# EasyEDA Pro project 单向户外电源_明月班.epro, board PCB4
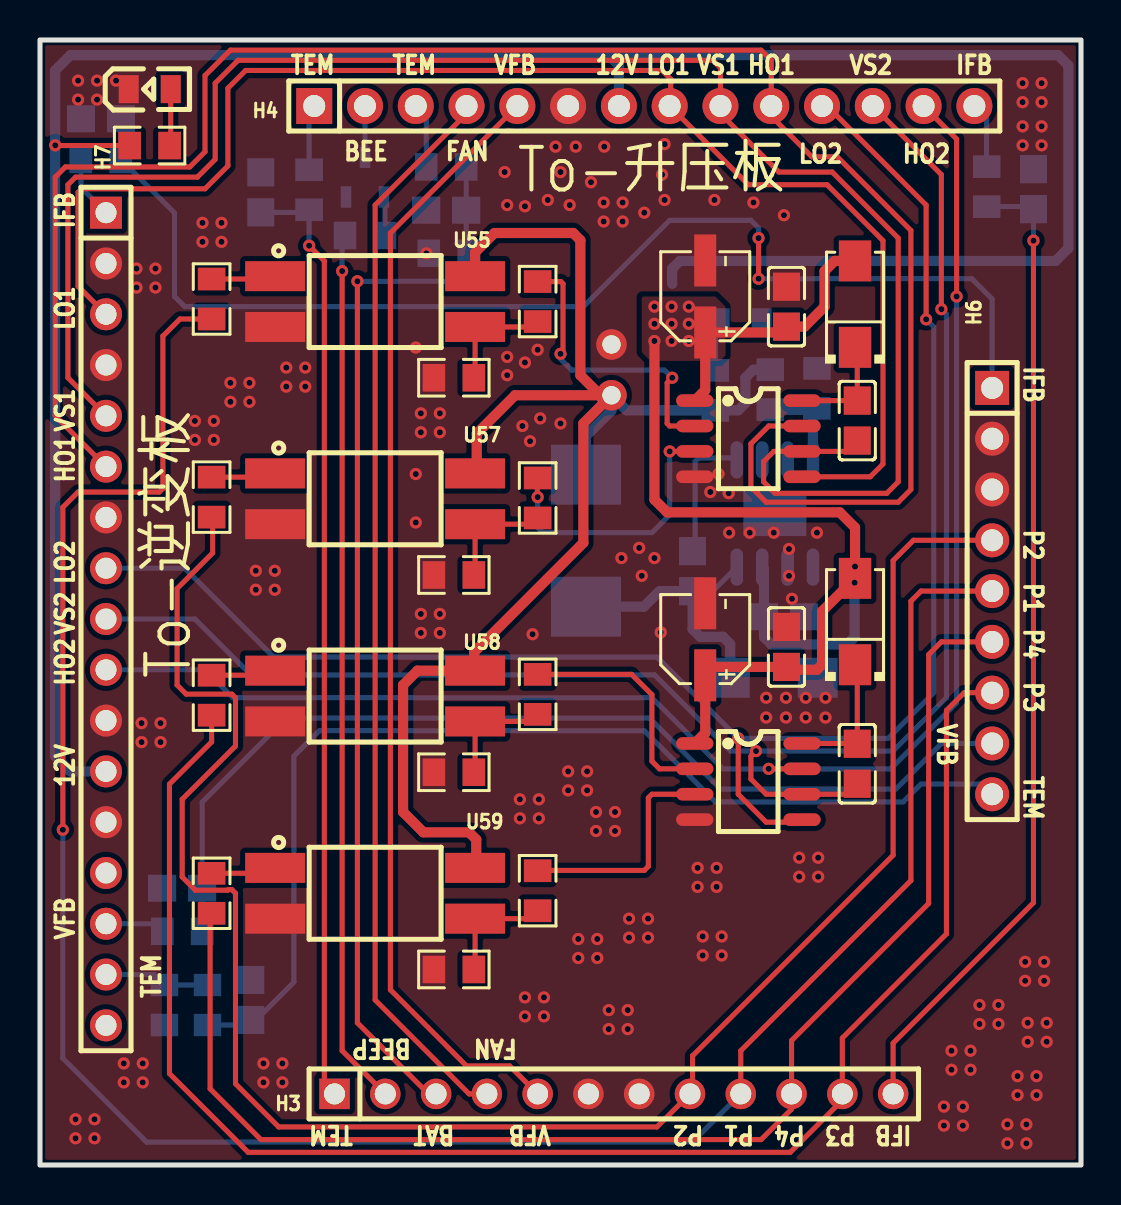
[diagram p12: board, top side]
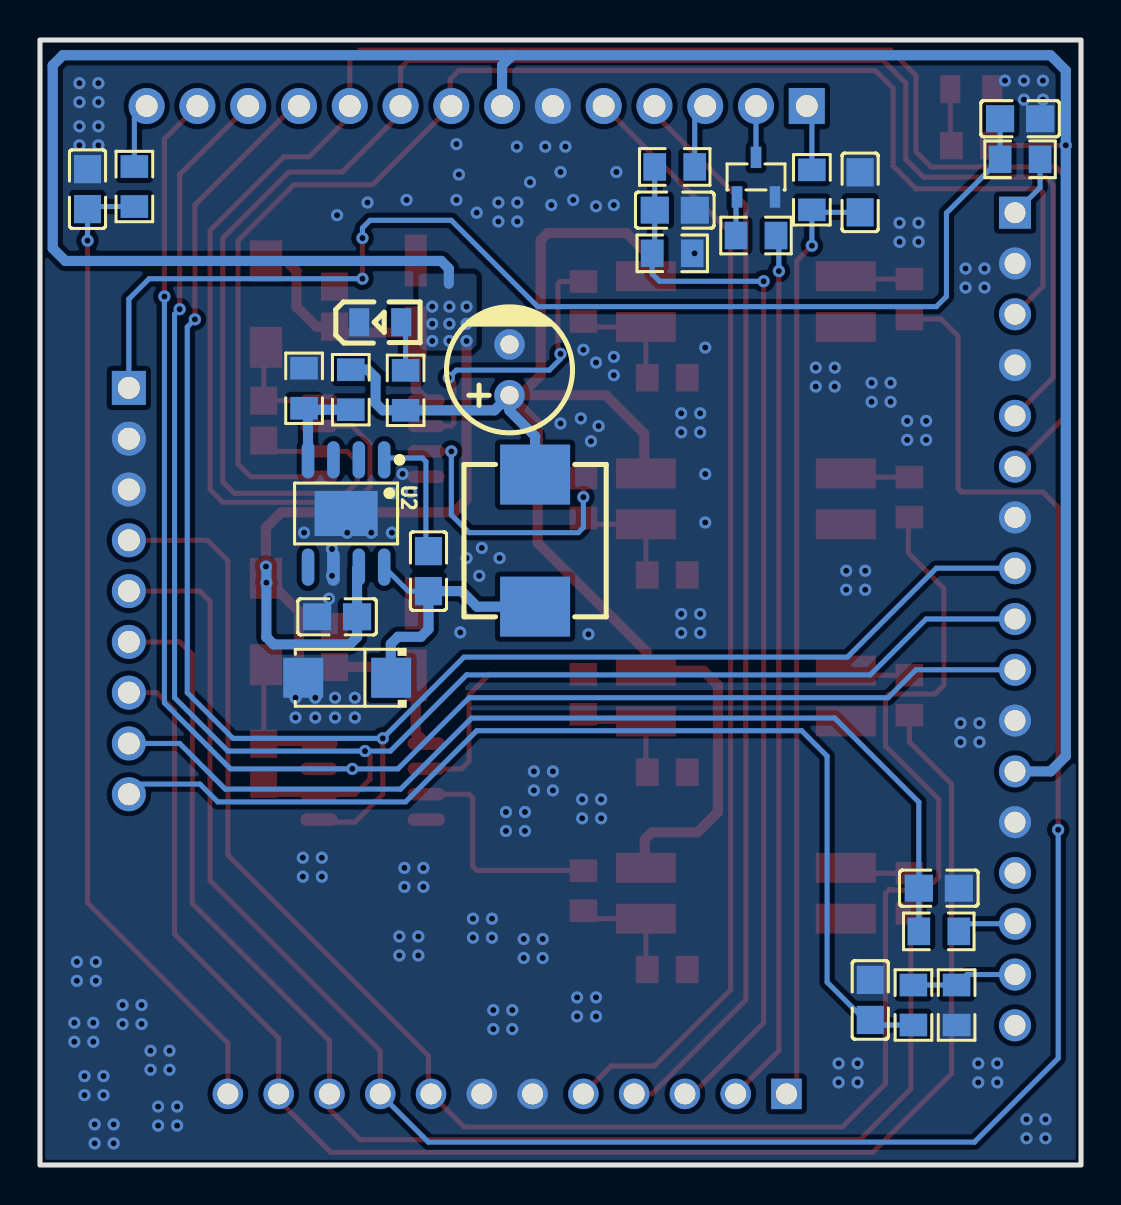
[diagram p13: board, bottom side, seen from below]

Outline 52.07 x 56.26 mm; copper layers: Top Layer, Bottom Layer. Coordinates in mm from the lower left corner of the outline.
Outline path: rectangle 0,56.26 52.07,0
Stack: Top Layer 0.035mm / Dielectric1 1.51mm FR4 er 4.5 / Bottom Layer 0.035mm

## Design rules (mm)
template: 自定义配置
spacing copperThickness1oz (default): track to track 0.102, other pairs 0.152 to 0.3
spacing copperThickness2oz: track to track 0.203, other pairs 0.152 to 0.3
track width copperThickness1oz (default): min 0.127, default 0.254, max 2.54
track width copperThickness2oz: min 0.203, default 0.254, max 2.54
differential pair differentialPair (default): width min 0.127, default 0.254, max 2.54; gap min 0.152, default 0.152
via viaSize (default): diameter min 0.5, default 0.61, max 10; hole min 0.3, default 0.305, max 6.3

## Placement (name value [footprint] x y rotation side)
C16  10uF  [CAP-SMD_BD4.0-L4.3-W4.3-LS5.1-FD]  33.27 43.43 90 top
C17  100nF  [C0805]  37.34 42.93 90 top
C18  1uF  [C0805]  40.88 37.23 90 top
C19  10uF  [CAP-SMD_BD4.0-L4.3-W4.3-LS5.1-FD]  33.27 26.29 90 top
C20  100nF  [C0805]  37.34 25.91 90 top
C21  1uF  [C0805]  40.88 20.07 90 top
C23  220uF  [CAP-D6.3×F2.5]  28.59 39.76 90 bottom
C25  100nF  [C0805]  49.69 48.8 270 bottom
C26  100nF  [C0805]  20.32 47.75 0 bottom
C27  100nF  [C0805]  11.05 48.64 270 bottom
C28  100nF  [C0805]  10.54 8.26 270 bottom
C29  100nF  [C0805]  7.11 13.84 0 bottom
C30  100nF  [C0805]  3.05 52.32 0 bottom
C31  10uF  [C0805]  37.21 27.41 180 bottom
C32  10nF  [C0805]  32.64 29.7 270 bottom
D18  FR107  [SMA_L4.2-W2.7-LS5.3-RD]  40.77 43.05 90 top
D19  FR107  [SMA_L4.2-W2.7-LS5.3-RD]  40.77 27.18 90 top
D20  B340A  [SMA_L4.3-W2.6-LS5.1-RD]  36.7 24.37 0 bottom
H3  -  [HDR-TH_12P-P2.54-V-M]  28.7 3.56 0 top
H4  -  [HDR-TH_14P-P2.54-V-M]  30.23 52.96 0 top
H6  -  [HDR-TH_9P-P2.54-V-M]  47.63 28.7 270 top
H7  -  [HDR-TH_17P-P2.54-V-M]  3.3 27.31 270 top
L1  15uH  [IND-SMD_L7.5-W6.6]  27.3 31.22 90 bottom
LED1  NCD0805R1  [LED0805-R-RD]  35.05 42.15 180 bottom
LED2  NCD0805R1  [LED0805-R-RD]  5.49 53.8 0 top
Q11  S8050  [SOT-23-3_L2.9-W1.3-P1.90-LS2.3-BR]  16.26 49.4 270 bottom
R25  100R  [R0805]  8.58 43.31 90 top
R26  100R  [R0805]  24.89 43.18 90 top
R27  10K  [R0805]  20.7 39.37 0 top
R28  100R  [R0805]  8.58 33.4 90 top
R29  100R  [R0805]  24.89 33.36 90 top
R30  10K  [R0805]  20.7 29.51 0 top
R31  100R  [R0805]  8.58 23.5 90 top
R32  100R  [R0805]  24.89 23.54 90 top
R33  10K  [R0805]  20.7 19.64 0 top
R34  100R  [R0805]  8.58 13.59 90 top
R35  100R  [R0805]  24.89 13.72 90 top
R36  10K  [R0805]  20.7 9.78 0 top
R39  10K  [R0805]  47.35 48.93 270 bottom
R40  1K  [R0805]  16.26 46.48 180 bottom
R41  22K  [R0805]  20.32 49.91 0 bottom
R42  2K  [R0805]  20.45 45.59 0 bottom
R43  1K  [R0805]  13.46 48.77 270 bottom
R44  10K  [R0805]  6.22 8 90 bottom
R45  1K  [R0805]  8.38 8 90 bottom
R46  1K  [R0805]  7.11 11.68 0 bottom
R47  1K  [R0805]  3.05 50.29 0 bottom
R50  10K  [R0805]  5.48 50.98 180 top
R51  2.7K  [R0805]  33.78 38.74 270 bottom
R52  3.24K  [R0805]  38.86 38.84 270 bottom
R53  10K  [R0805]  36.52 38.77 90 bottom
U2  TPS5430DDA  [ESOP-8_L4.9-W3.9-P1.27-LS6.0-BL-EP-2]  36.76 32.58 0 bottom
U55  LTV-817S-TA1-C  [OPTO-SMD-4_L4.6-W6.5-P2.54-LS10.3-BL]  16.76 43.18 270 top
U56  EG2132  [SOP-8_L4.9-W3.9-P1.27-LS6.0-BL]  35.43 36.32 270 top
U57  LTV-817S-TA1-C  [OPTO-SMD-4_L4.6-W6.5-P2.54-LS10.3-BL]  16.76 33.32 270 top
U58  LTV-817S-TA1-C  [OPTO-SMD-4_L4.6-W6.5-P2.54-LS10.3-BL]  16.76 23.45 270 top
U59  LTV-817S-TA1-C  [OPTO-SMD-4_L4.6-W6.5-P2.54-LS10.3-BL]  16.76 13.59 270 top
U60  EG2132  [SOP-8_L4.9-W3.9-P1.27-LS6.0-BL]  35.43 19.18 270 top

## Footprints (pads in the part's own frame, mm; a bottom-side part is the same pattern mirrored in y, then rotated)
C0805
  rect 1.41x1.35 smd: 1(-1,0) 2(1,0)
CAP-D6.3×F2.5
  round 1.524 hole 0.914: 1(-1.27,0) 2(1.27,0)
CAP-SMD_BD4.0-L4.3-W4.3-LS5.1-FD
  rect 2.6x1.1 smd: 1(-1.8,0) 2(1.8,0)
ESOP-8_L4.9-W3.9-P1.27-LS6.0-BL-EP-2
  oval 0.63x1.865 smd: 1(-1.905,-2.683) 2(-0.635,-2.683) 3(0.635,-2.683) 4(1.905,-2.683) 5(1.905,2.683) 6(0.635,2.683) 7(-0.635,2.683) 8(-1.905,2.683)
  rect 3.15x2.26 smd: 9(0,0)
HDR-TH_9P-P2.54-V-M
  rect 1.7x1.7 hole 1.1: 1(-10.16,0)
  round 1.7 hole 1.1: 2(-7.62,0) 3(-5.08,0) 4(-2.54,0) 5(0,0) 6(2.54,0) 7(5.08,0) 8(7.62,0) 9(10.16,0)
HDR-TH_12P-P2.54-V-M
  rect 1.524x1.524 hole 1.05: 1(-13.97,0)
  round 1.524 hole 1.05: 2(-11.43,0) 3(-8.89,0) 4(-6.35,0) 5(-3.81,0) 6(-1.27,0) 7(1.27,0) 8(3.81,0) 9(6.35,0) 10(8.89,0) 11(11.43,0) 12(13.97,0)
HDR-TH_14P-P2.54-V-M
  rect 1.8x1.8 hole 1.1: 1(-16.51,0)
  round 1.8 hole 1.1: 2(-13.97,0) 3(-11.43,0) 4(-8.89,0) 5(-6.35,0) 6(-3.81,0) 7(-1.27,0) 8(1.27,0) 9(3.81,0) 10(6.35,0) 11(8.89,0) 12(11.43,0) 13(13.97,0) 14(16.51,0)
HDR-TH_17P-P2.54-V-M
  rect 1.6x1.6 hole 1.05: 1(-20.32,0)
  round 1.6 hole 1.05: 2(-17.78,0) 3(-15.24,0) 4(-12.7,0) 5(-10.16,0) 6(-7.62,0) 7(-5.08,0) 8(-2.54,0) 9(0,0) 10(2.54,0) 11(5.08,0) 12(7.62,0) 13(10.16,0) 14(12.7,0) 15(15.24,0) 16(17.78,0) 17(20.32,0)
IND-SMD_L7.5-W6.6
  rect 3x3.5 smd: 1(-3.302,0) 2(3.302,0)
LED0805-R-RD
  rect 1x1.399 smd: 1(1.05,0) 2(-1.05,0)
OPTO-SMD-4_L4.6-W6.5-P2.54-LS10.3-BL
  rect 1.5x3 smd: 1(-1.27,-5) 2(1.27,-5) 3(1.27,5) 4(-1.27,5)
R0805
  rect 1.133x1.377 smd: 1(-1,0) 2(1,0)
SMA_L4.2-W2.7-LS5.3-RD
  rect 2.046x1.62 smd: 1(-2.16,0) 2(2.16,0)
SMA_L4.3-W2.6-LS5.1-RD
  rect 2x2 smd: 1(-2.2,0) 2(2.2,0)
SOP-8_L4.9-W3.9-P1.27-LS6.0-BL
  oval 0.63x1.865 smd: 1(-1.905,-2.683) 2(-0.635,-2.683) 3(0.635,-2.683) 4(1.905,-2.683) 5(1.905,2.683) 6(0.635,2.683) 7(-0.635,2.683) 8(-1.905,2.683)
SOT-23-3_L2.9-W1.3-P1.90-LS2.3-BR
  rect 1.07x0.532 smd: 1(0.99,-0.95) 2(0.99,0.95) 3(-0.99,0)

## Nets
As in the schematic.

Pads without a net: H7 14 17; U2 2 3 5

## Via types
v1: diameter 0.61, hole 0.305, Top Layer to Bottom Layer, 215 vias

## Routing (per net, layer and track width the routed paths; a pad name or vN(x,y) marks a point on that pad's centre or on a via; arc(x,y) is an arc through that point)
5V: length 71.1
  Top Layer w0.508: U57.4 21.84,34.67 21.84,36.58 23.76,38.49 28.03,38.49 27.03,39.5 27.03,46.25 26.67,46.61 22.73,46.61 21.76,45.64 U55.4 ; C23.1 27.18,37.09 27.18,31.12 21.72,25.65 21.72,24.77 U58.4 18.88,24.72 18.16,24 18.16,17.65 19.18,16.64 21.46,16.64 21.82,16.28 21.82,14.92 U59.4
  Bottom Layer w0.508: L1.2 27.3,36.45 28.59,37.73 C23.1 29.34,37.74 R51.2 34.92,37.74 35.28,38.1 35.28,39.37 35.69,39.77 R53.2
12V: length 186.3
  Top Layer w0.254: R50.2 0.76,50.98
  Top Layer w0.508: U56.1 33.27,38.75 33.27,41.63 37.05,41.63 C17.1 38.24,41.93 39.24,42.93 39.24,44.7 39.75,45.21 D18.2 ; U60.1 33.27,21.61 C19.1 33.69,24.91 C20.1 37.48,24.77 38.86,24.77 39.12,25.02 39.12,27.69 D19.2 v1(40.77,29.93) 40.77,31.88 40.01,32.64 31.37,32.64 30.73,33.27 v1(30.73,41.21)
  Bottom Layer w0.508: 28.45,55.5 50.93,55.5 51.44,54.99 51.44,45.85 50.8,45.21 32,45.21 31.62,44.83 31.62,44.07 ; 28.45,55.5 1.52,55.5 0.76,54.74 v1(0.76,50.99) 0.76,20.45 1.52,19.69 H7.12 ; 28.45,55.5 28.96,54.99 H4.7 ; 40.75,29.85 v1(40.75,29.12) 40.75,26.39 40.39,26.04 36.58,26.04 36.21,26.4 C31.2 36.21,29.81 U2.7
  vias: v1(30.73,42.93) v1(30.73,42.07) v1(31.59,42.93) v1(31.59,42.07) v1(31.59,41.21) v1(32.45,42.93) v1(32.45,42.07) v1(32.45,41.21)
GND:
  vias: v1(1.78,2.29) v1(1.78,1.34) v1(1.91,54.23) v1(1.91,53.28) v1(2.73,2.29) v1(2.73,1.34) v1(2.85,54.23) v1(2.85,53.28) v1(3.8,54.23) v1(4.19,5.08) v1(4.19,4.13) v1(4.83,44.83) v1(4.83,43.88) v1(5.08,22.1) v1(5.08,21.15) v1(5.14,5.08) v1(5.14,4.13) v1(5.78,44.83) v1(5.78,43.88) v1(6.03,22.1) v1(6.03,21.15) v1(7.75,37.21) v1(7.75,36.26) v1(8.13,47.12) v1(8.13,46.17) v1(8.7,37.21) v1(8.7,36.26) v1(9.08,47.12) v1(9.08,46.17) v1(9.52,39.12) v1(9.52,38.17) v1(10.47,39.12) v1(10.47,38.17) v1(10.8,29.72) v1(10.8,28.77) v1(11.18,5.08) v1(11.18,4.13) v1(11.74,29.72) v1(11.74,28.77) v1(12.13,5.08) v1(12.13,4.13) v1(12.32,39.88) v1(12.32,38.93) v1(13.27,39.88) v1(13.27,38.93) v1(18.8,40.88) v1(18.8,34.55) v1(18.8,32.13) v1(19.05,37.59) v1(19.05,36.64) v1(19.05,27.56) v1(19.05,26.61) v1(19.33,45.59) v1(20,37.59) v1(20,36.64) v1(20,27.56) v1(20,26.61) v1(23.24,49.66) v1(23.37,48.01) v1(23.37,40.41) v1(23.37,39.5) v1(24,18.29) v1(24,17.34) v1(24.13,36.96) v1(24.26,47.95) v1(24.26,40.13) v1(24.26,8.38) v1(24.26,7.43) v1(24.51,36.2) v1(24.64,26.54) v1(24.89,40.77) v1(25.02,37.34) v1(24.95,18.29) v1(24.95,17.34) v1(25.21,8.38) v1(25.21,7.43) v1(25.4,48.26) v1(25.79,50.93) v1(26.04,49.66) v1(26.04,37.08) v1(26.42,19.69) v1(26.42,18.74) v1(26.49,48.01) v1(26.8,50.93) v1(26.92,11.3) v1(26.92,10.35) v1(27.37,19.69) v1(27.37,18.74) v1(27.56,49.15) v1(27.81,17.65) v1(27.81,16.7) v1(27.87,11.3) v1(27.87,10.35) v1(28.22,50.93) v1(28.19,48.13) v1(28.19,47.18) v1(28.45,7.75) v1(28.45,6.8) v1(28.76,17.65) v1(28.76,16.7) v1(29.08,30.35) v1(29.14,48.13) v1(29.14,47.18) v1(29.4,7.75) v1(29.4,6.8) v1(29.46,12.32) v1(29.46,11.37) v1(29.97,30.86) v1(30.1,29.46) v1(30.23,47.62) v1(30.41,12.32) v1(30.41,11.37) v1(30.73,30.35) v1(31.11,49.53) v1(31.05,26.64) v1(31.24,51.05) v1(31.24,48.26) v1(32.89,14.86) v1(32.89,13.91) v1(33.15,11.43) v1(33.15,10.48) v1(33.53,33.66) v1(33.73,48.26) v1(33.84,14.86) v1(33.84,13.91) v1(33.94,34.56) v1(34.1,11.43) v1(34.1,10.48) v1(34.45,33.6) v1(34.47,31.62) v1(35.5,31.62) v1(35.69,48.13) v1(36.32,23.37) v1(36.32,22.38) v1(36.7,31.62) v1(37.21,47.5) v1(37.31,23.37) v1(37.31,22.38) v1(37.47,30.81) v1(37.47,29.46) v1(37.61,28.32) v1(37.97,15.37) v1(37.97,14.42) v1(38.3,23.37) v1(38.3,22.38) v1(38.86,31.62) v1(38.92,15.37) v1(38.92,14.42) v1(39.29,23.37) v1(39.29,22.38) v1(45.21,2.92) v1(45.21,1.97) v1(45.59,5.72) v1(45.59,4.77) v1(46.16,2.92) v1(46.16,1.97) v1(46.54,5.72) v1(46.54,4.77) v1(46.99,8) v1(46.99,7.05) v1(47.94,8) v1(47.94,7.05) v1(48.39,2.03) v1(48.39,1.08) v1(48.89,4.44) v1(48.89,3.5) v1(49.15,54.1) v1(49.15,53.15) v1(49.15,51.94) v1(49.15,50.99) v1(49.28,10.16) v1(49.28,9.21) v1(49.4,7.11) v1(49.4,6.16) v1(49.34,2.03) v1(49.34,1.08) v1(49.84,4.44) v1(49.84,3.5) v1(50.1,54.1) v1(50.1,53.15) v1(50.1,51.94) v1(50.1,50.99) v1(50.23,10.16) v1(50.23,9.21) v1(50.35,7.11) v1(50.35,6.16)
BATIN: length 3.3
  Bottom Layer w0.254: H4.3 19.32,52.44 R41.1
BATOUT: length 53.6
  Top Layer w0.254: v1(15.88,44.2) 15.88,7.11 19.43,3.56 H3.3
  Bottom Layer w0.254: v1(15.88,44.2) 21.08,44.2 21.45,44.56 R42.2 21.32,45.72 C26.2 R41.2
BEEPIN: length 2.6
  Bottom Layer w0.254: Q11.3 H4.2
BEEPOUT: length 43.9
  Top Layer w0.254: v1(15.11,44.7) 15.11,5.72 H3.2
  Bottom Layer w0.254: R40.2 15.11,46.34 v1(15.11,44.7)
FAN: length 54.1
  Top Layer w0.254: H3.4 21.46,3.56 16.76,8.26 16.76,48.01 21.34,52.58 H4.4
HO1: length 95.2
  Top Layer w0.254: H7.6 0.76,37.47 0.76,49.4 1.27,49.91 7.49,49.91 8.26,50.67 8.26,54.48 9.52,55.75 36.07,55.75 36.58,55.25 H4.10 36.58,52.45 38.61,50.42 39.88,50.42 43.56,46.74 43.56,33.78 42.93,33.15 36.32,33.15 35.56,33.91 35.56,36.07 36.45,36.96 U56.7
HO2: length 78.2
  Top Layer w0.254: H4.13 45.85,51.31 v1(45.85,43.43) ; U60.7 v1(36.45,19.81)
  Bottom Layer w0.254: v1(45.85,43.43) 45.85,23.11 42.55,19.81 v1(36.45,19.81) 34.16,19.81 30.61,23.37 9.65,23.37 8.26,24.77 H7.10
IFB2: length 3.2
  Bottom Layer w0.254: R47.1 2.05,48.88 H7.1
IFBIN1: length 3.3
  Bottom Layer w0.254: R39.1 47.35,52.35 H4.14
IFBOUT1: length 49.6
  Top Layer w0.254: v1(49.69,46.23) 49.69,13.12 42.67,6.1 H3.12
  Bottom Layer w0.254: R39.2 49.56,47.93 C25.2 v1(49.69,46.23)
IFBOUT2: length 60.5
  Top Layer w0.254: v1(35.94,44.32) v1(35.94,46.36)
  Bottom Layer w0.254: H6.1 47.63,43.31 46.61,44.32 v1(35.94,44.32) ; C30.2 R47.2 6.73,47.61 6.73,43.43 7.24,42.93 27.18,42.93 31.5,47.24 35.56,47.24 35.94,46.86 v1(35.94,46.36)
LO1: length 71.6
  Top Layer w0.254: U56.5 41.53,34.42 42.16,35.05 42.16,46.23 39.37,49.02 35.43,49.02 H4.8 31.55,53.01 31.55,54.3 31.11,54.74 10.29,54.74 9.4,53.85 9.4,49.96 8.26,48.82 2.08,48.82 1.91,48.64 1.91,43.94 H7.3
LO2: length 84.3
  Top Layer w0.254: U60.5 37.99,17.15 36.32,17.15 34.92,18.54 v1(34.92,21.34) ; v1(44.32,42.29) 44.32,48.01 39.37,52.96 H4.11
  Bottom Layer w0.254: v1(44.32,42.29) 44.7,41.91 44.7,23.62 42.42,21.34 v1(34.92,21.34) 30.86,25.4 11.68,25.4 7.24,29.85 H7.8
P1-IN: length 112.4
  Top Layer w0.254: R25.1 7,42.31 6.15,41.45 6.15,33.83 5.97,33.66 1.91,33.66 1.14,32.89 v1(1.14,16.76) ; H3.9 35.05,5.72 43.56,14.22 43.56,28.19 44.07,28.7 H6.5
  Bottom Layer w0.254: v1(1.14,16.76) 1.14,5.33 5.33,1.14 32.64,1.14 H3.9
P1-OUT: length 15
  Top Layer w0.254: v1(26.04,40.57) 26.16,40.57 26.16,44.07 26.05,44.18 R26.2 ; v1(31.62,39.37) 31.37,39.12 31.37,37.08 31.5,36.96 U56.2
  Bottom Layer w0.254: v1(26.04,40.57) 26.04,40.31 26.6,39.75 31.24,39.75 v1(31.62,39.37)
P2-IN: length 95.5
  Top Layer w0.254: 47.63,31.24 43.69,31.24 42.67,30.23 42.67,15.49 32.64,5.46 32.64,3.68 H3.8 30.86,1.91 11.94,1.91 9.78,4.06 9.78,13.59 9.6,13.77 9.41,13.77 9.39,13.74 7.77,13.74 7.11,14.41 7.11,18.29 9.78,20.96 9.78,23.37 9.6,23.55 7.31,23.55 6.86,24 6.86,28.83 8.64,30.61 8.64,32.35 R28.1
P2-OUT: length 14
  Top Layer w0.254: v1(24.89,33.4) 24.88,33.42 24.88,34.34 R29.2 ; U56.3 v1(31.5,35.69)
  Bottom Layer w0.254: v1(31.5,35.69) 31.5,32.51 30.61,31.62 25.15,31.62 24.89,31.88 v1(24.89,33.4)
P3-IN: length 79.5
  Top Layer w0.254: 47.63,23.62 46.23,23.62 45.34,22.73 45.34,11.56 40.13,6.35 H3.11 40.13,3.24 37.53,0.64 10.41,0.64 6.48,4.57 6.48,19.05 8.58,21.16 R31.1
P3-OUT: length 11.8
  Top Layer w0.254: R32.2 29.59,24.54 30.61,23.52 30.61,20.19 30.99,19.81 U60.2
P4-IN: length 68.6
  Top Layer w0.254: R34.1 8.51,12.51 8.51,3.81 11.05,1.27 36.07,1.27 37.59,2.79 H3.10 37.59,6.22 44.45,13.08 44.45,25.53 45.08,26.16 H6.6
P4-OUT: length 11.5
  Top Layer w0.254: U60.3 30.61,18.54 30.43,18.36 30.43,14.93 30.23,14.73 24.91,14.73 R35.2
TEMPIN: length 3.3
  Bottom Layer w0.254: H4.1 13.46,52.71 R43.1
TEMPIN2: length 5.3
  Bottom Layer w0.254: H7.16 5.7,9.53 R44.2 R45.2
TEMPOUT: length 47.2
  Top Layer w0.254: H3.1 14.22,4.06 14.22,45.21 v1(13.46,45.97)
  Bottom Layer w0.254: C27.2 13.33,47.64 R43.2 v1(13.46,45.97)
TEMPOUT2: length 54
  Bottom Layer w0.254: 47.63,18.54 47.12,19.05 44.07,19.05 43.18,18.16 33.78,18.16 30.23,21.72 13.97,21.72 12.7,20.45 12.7,9.14 10.81,7.26 C28.2 10.29,7 R45.1
VFB: length 56.3
  Top Layer w0.254: H4.5 17.53,46.61 17.53,8.76 21.34,4.95 23.5,4.95 H3.5
VFB2: length 3
  Bottom Layer w0.254: R46.1 5.73,12.07 H7.15
VFBOUT2: length 50.1
  Bottom Layer w0.254: R46.2 C29.2 8.11,18.15 12.32,22.35 30.48,22.35 34.04,18.8 42.8,18.8 45.08,21.08 H6.8
VS1: length 89.2
  Top Layer w0.254: C18.1 40.34,35.69 U56.6 36.7,35.69 36.2,35.18 36.2,34.16 36.77,33.59 42.35,33.59 42.93,34.16 42.93,46.36 39.62,49.66 36.96,49.66 34.04,52.58 H4.9 34.04,54.86 33.66,55.25 9.91,55.25 8.76,54.1 8.76,50.29 7.87,49.4 1.78,49.4 1.4,49.02 1.4,39.37 H7.5
VS2: length 84.3
  Top Layer w0.254: H4.12 45.08,49.53 v1(45.08,42.8) ; C21.1 40.35,18.54 U60.6 36.32,18.54 35.56,19.3 35.56,20.45 v1(35.81,20.7)
  Bottom Layer w0.254: v1(45.08,42.8) 45.34,42.55 45.34,23.37 42.67,20.7 v1(35.81,20.7) 34.54,20.7 30.73,24.51 10.54,24.51 7.75,27.31 H7.9
$1N2145: length 3.2
  Top Layer w0.254: R25.2 11.62,44.31 U55.1
$1N2151: length 5.8
  Top Layer w0.254: R26.1 24.62,41.91 U55.3 21.76,39.43 R27.2
$1N2169: length 5.5
  Top Layer w0.254: D18.1 40.88,40.78 C18.2 U56.8
$1N2174: length 3.3
  Top Layer w0.254: R28.2 11.58,34.4 U57.1
$1N2180: length 5.8
  Top Layer w0.254: R29.1 24.58,32.05 U57.3 21.76,29.57 R30.2
$1N2184: length 3.3
  Top Layer w0.254: R31.2 11.54,24.5 U58.1
$1N2190: length 5.8
  Top Layer w0.254: R33.2 21.76,19.71 U58.3 24.54,22.18 R32.1
$1N2194: length 3.3
  Top Layer w0.254: U59.1 11.49,14.59 R34.2
$1N2200: length 5.9
  Top Layer w0.254: R35.1 24.5,12.32 U59.3 21.76,9.84 R36.2
$1N2218: length 6.8
  Top Layer w0.254: U60.8 40.86,21.08 C21.2 40.88,24.91 D19.1
$1N2226: length 6.7
  Bottom Layer w0.254: U2.1 34.76,35.36 32.95,35.36 32.77,35.18 32.77,30.83 C32.1
$1N2227: length 14.2
  Bottom Layer w0.254: U2.8 33.65,28.7 32.82,28.7
  Bottom Layer w0.508: C32.2 32.64,26.8 33.02,26.42 34.16,26.42 34.52,26.06 34.52,24.39 D20.1 ; C32.2 32.82,28.7 ; C32.2 30.99,28.7 30.21,27.92 L1.1
$1N2251: length 2
  Bottom Layer w0.254: R40.1 17.26,48.36 Q11.1
$1N2628: length 2.5
  Bottom Layer w0.254: LED1.1 33.78,41.93 R51.1
$1N2716: length 2.8
  Top Layer w0.254: R50.1 6.54,51.04 LED2.1
$1N4175: length 4.9
  Bottom Layer w0.508: U2.4 38.66,37.64 38.79,37.77 ; 38.79,37.77 R53.1 ; 38.79,37.77 R52.2

## Copper pours and planes (outline as drawn; the poured copper is in the pictures)
12V on Top Layer: 30.13,43.43 33.78,43.43 34.29,42.93 34.29,40.49 34.01,40.21 30.53,40.21 30.1,40.64 30.1,43.4
12V on Bottom Layer: 30.35,44.58 33.02,44.58 33.15,44.45 33.15,41.01 32.86,40.73 30.52,40.73 30.23,41.02 30.23,44.45
GND on Top Layer: 0.13,56.39 52.2,56.39 52.2,0.13 0.13,0.13
GND on Bottom Layer: 0.13,56.39 52.2,56.39 52.2,0.13 0.13,0.13

## Text on the board
Top Silkscreen Layer: TEM | BEE | FAN | VFB | 12V | LO1 | VS1 | HO1 | LO2 | VS2 | HO2 | IFB | BAT | P2 | P1 | P4 | P3 | BEEP | To-升压板 | To-逆变板
